# Altium schematic sheet [06] - AUDIO.SchDoc: DOCUMENT TITLE
size A3; Organization: Tor Brodtkorb; Address1: Frode Rinnans veg 193; Address2: 7050 Trondheim; DocumentNumber: 6598; Revision: 1.0; SheetNumber: 1; SheetTotal: 1
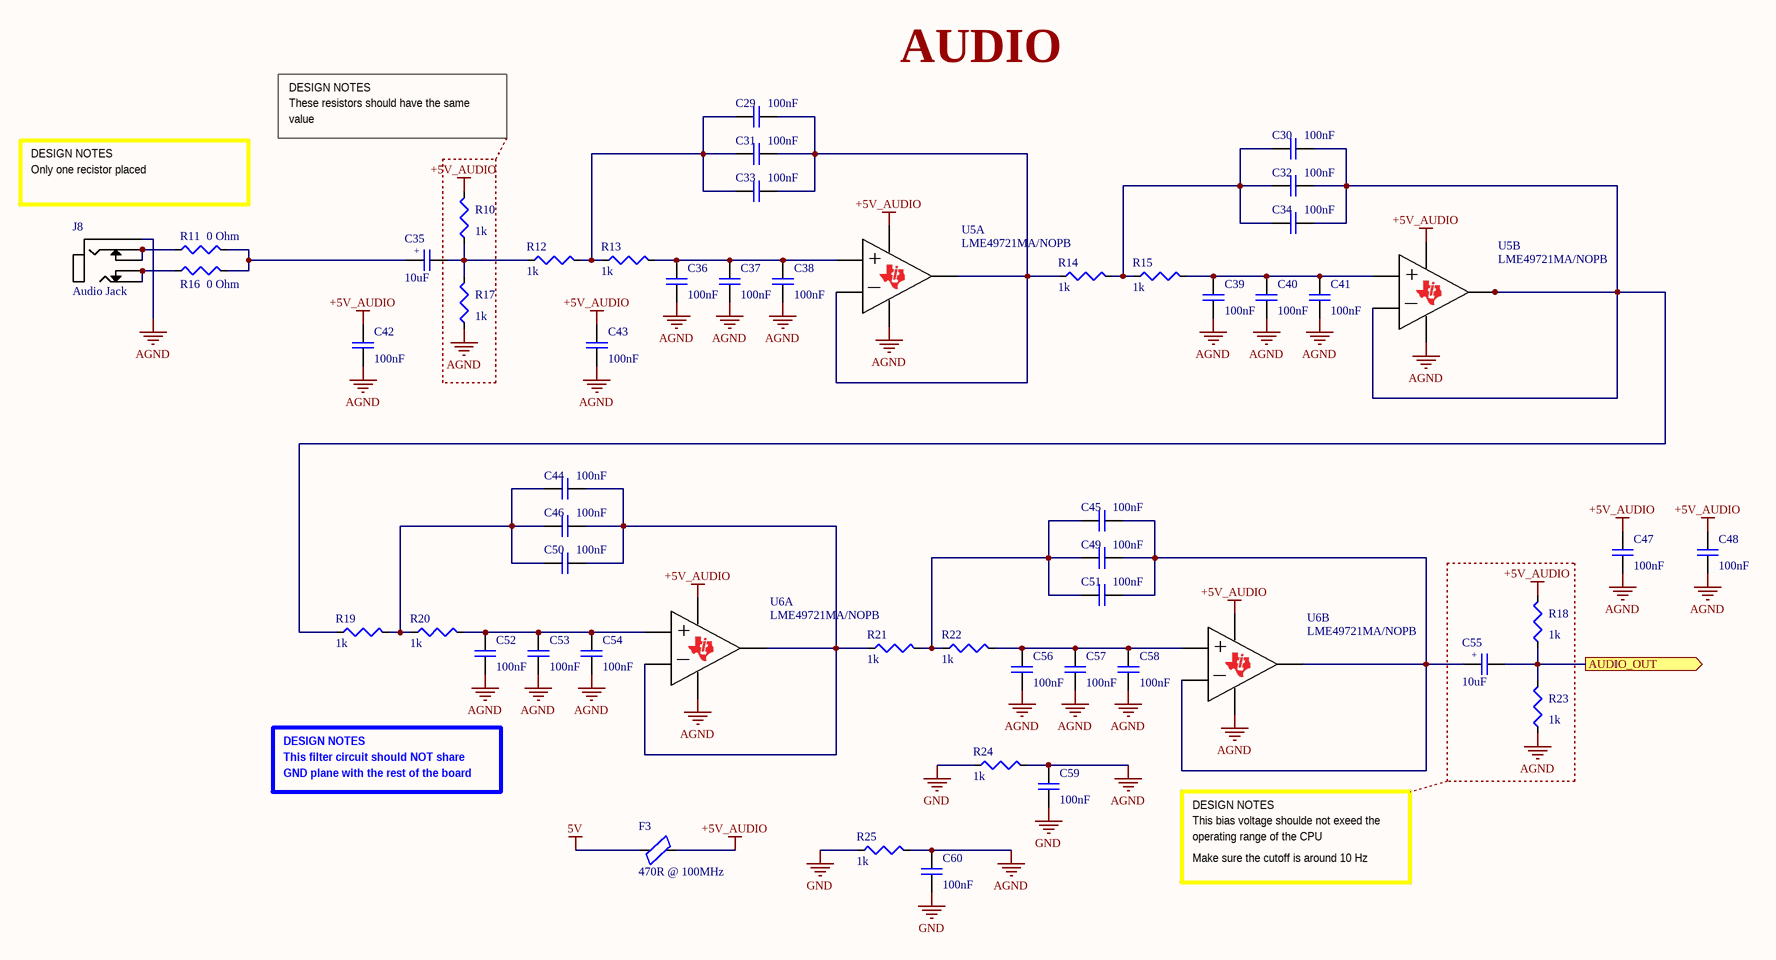
[diagram p0: [06] - AUDIO.SchDoc]

## Parts
C29  value 100nF  [C0603]  (hidden comment: 02016D104KAT2A)
C30  value 100nF  [C0603]  (hidden comment: 02016D104KAT2A)
C31  value 100nF  [C0603]  (hidden comment: 02016D104KAT2A)
C32  value 100nF  [C0603]  (hidden comment: 02016D104KAT2A)
C33  value 100nF  [C0603]  (hidden comment: 02016D104KAT2A)
C34  value 100nF  [C0603]  (hidden comment: 02016D104KAT2A)
C35  value 10uF  [Capacitor electrolytic SMD 4x5.4]  (hidden comment: EEE1HA2R2SR)
C36  value 100nF  [C0603]  (hidden comment: 02016D104KAT2A)
C37  value 100nF  [C0603]  (hidden comment: 02016D104KAT2A)
C38  value 100nF  [C0603]  (hidden comment: 02016D104KAT2A)
C39  value 100nF  [C0603]  (hidden comment: 02016D104KAT2A)
C40  value 100nF  [C0603]  (hidden comment: 02016D104KAT2A)
C41  value 100nF  [C0603]  (hidden comment: 02016D104KAT2A)
C42  value 100nF  [C0603]  (hidden comment: 02016D104KAT2A)
C43  value 100nF  [C0603]  (hidden comment: 02016D104KAT2A)
C44  value 100nF  [C0603]  (hidden comment: 02016D104KAT2A)
C45  value 100nF  [C0603]  (hidden comment: 02016D104KAT2A)
C46  value 100nF  [C0603]  (hidden comment: 02016D104KAT2A)
C47  value 100nF  [C0603]  (hidden comment: 02016D104KAT2A)
C48  value 100nF  [C0603]  (hidden comment: 02016D104KAT2A)
C49  value 100nF  [C0603]  (hidden comment: 02016D104KAT2A)
C50  value 100nF  [C0603]  (hidden comment: 02016D104KAT2A)
C51  value 100nF  [C0603]  (hidden comment: 02016D104KAT2A)
C52  value 100nF  [C0603]  (hidden comment: 02016D104KAT2A)
C53  value 100nF  [C0603]  (hidden comment: 02016D104KAT2A)
C54  value 100nF  [C0603]  (hidden comment: 02016D104KAT2A)
C55  value 10uF  [Capacitor electrolytic SMD 4x5.4]  (hidden comment: EEE1HA2R2SR)
C56  value 100nF  [C0603]  (hidden comment: 02016D104KAT2A)
C57  value 100nF  [C0603]  (hidden comment: 02016D104KAT2A)
C58  value 100nF  [C0603]  (hidden comment: 02016D104KAT2A)
C59  value 100nF  [C0603]  (hidden comment: 02016D104KAT2A)
C60  value 100nF  [C0603]  (hidden comment: 02016D104KAT2A)
F3  value 470R @ 100MHz  [Ferrite bead 0603]  (hidden comment: BLM18AG121SN1D)
J8  Audio Jack  [Audio jack flat]
R10  value 1k  [R0603]  (hidden comment: CPF-A-0603B100KE1)
R11  value 0 Ohm  [R0603]  (hidden comment: CPF-A-0603B100KE1)
R12  value 1k  [R0603]  (hidden comment: CPF-A-0603B100KE1)
R13  value 1k  [R0603]  (hidden comment: CPF-A-0603B100KE1)
R14  value 1k  [R0603]  (hidden comment: CPF-A-0603B100KE1)
R15  value 1k  [R0603]  (hidden comment: CPF-A-0603B100KE1)
R16  value 0 Ohm  [R0603]  (hidden comment: CPF-A-0603B100KE1)
R17  value 1k  [R0603]  (hidden comment: CPF-A-0603B100KE1)
R18  value 1k  [R0603]  (hidden comment: CPF-A-0603B100KE1)
R19  value 1k  [R0603]  (hidden comment: CPF-A-0603B100KE1)
R20  value 1k  [R0603]  (hidden comment: CPF-A-0603B100KE1)
R21  value 1k  [R0603]  (hidden comment: CPF-A-0603B100KE1)
R22  value 1k  [R0603]  (hidden comment: CPF-A-0603B100KE1)
R23  value 1k  [R0603]  (hidden comment: CPF-A-0603B100KE1)
R24  value 1k  [R0603]  (hidden comment: CPF-A-0603B100KE1)
R25  value 1k  [R0603]  (hidden comment: CPF-A-0603B100KE1)
U5  LME49721MA/NOPB  [LME49721MA/NOPB]  (parts A,B of 2)
U6  LME49721MA/NOPB  [LME49721MA/NOPB]  (parts A,B of 2)

## Ports
AUDIO_OUT (out)

## Nets
5V: F3.1
+5V_AUDIO: C42.2 C43.2 C47.2 C48.2 F3.2 R10.2 R18.2 U5.8(VDD) U6.8(VDD)
AGND: C36.1 C37.1 C38.1 C39.1 C40.1 C41.1 C42.1 C43.1 C47.1 C48.1 C52.1 C53.1 C54.1 C56.1 C57.1 C58.1 C59.2 C60.2 J8.1 R17.1 R23.1 R24.2 R25.2 U5.4(VDD) U6.4(VDD)
GND: C59.1 C60.1 R24.1 R25.1
AUDIO_OUT: C55.2 R18.1 R23.2 ; port AUDIO_OUT
NetC29_1: C29.1 C31.1 C33.1 R12.2 R13.1
NetC29_2: C29.2 C31.2 C33.2 R14.1 U5.1(VDD) U5.2(VDD)
NetC30_1: C30.1 C32.1 C34.1 R14.2 R15.1
NetC30_2: C30.2 C32.2 C34.2 R19.1 U5.6(VDD) U5.7(VDD)
NetC35_1: C35.1 R11.2 R16.2
NetC35_2: C35.2 R10.1 R12.1 R17.2
NetC36_2: C36.2 C37.2 C38.2 R13.2 U5.3(VDD)
NetC39_2: C39.2 C40.2 C41.2 R15.2 U5.5(VDD)
NetC44_1: C44.1 C46.1 C50.1 R19.2 R20.1
NetC44_2: C44.2 C46.2 C50.2 R21.1 U6.1(VDD) U6.2(VDD)
NetC45_1: C45.1 C49.1 C51.1 R21.2 R22.1
NetC45_2: C45.2 C49.2 C51.2 C55.1 U6.6(VDD) U6.7(VDD)
NetC52_2: C52.2 C53.2 C54.2 R20.2 U6.3(VDD)
NetC56_2: C56.2 C57.2 C58.2 R22.2 U6.5(VDD)
NetJ8_2: J8.2 J8.3 R11.1
NetJ8_4: J8.4 J8.5 R16.1

## Notes on the sheet
- DESIGN NOTES
- These resistors should have the same
- value
- AUDIO
- Only one recistor placed
- This filter circuit should NOT share
- GND plane with the rest of the board
- This bias voltage shoulde not exeed the
- operating range of the CPU
- Make sure the cutoff is around 10 Hz
- Title
- Size:
- Date:
- A3
- Number:
- Time:
- Revision:
- Sheet
- of
- File:
- (in symbol EEE1HA2R2SR) +
- (in symbol LME49721MA/NOPB, part A) +; _
- (in symbol LME49721MA/NOPB, part B) +; _

## Library data of the parts
C29-C34 C36-C54 C56-C60 = 02016D104KAT2A: C0603
C35 C55 = EEE1HA2R2SR: El. Capacitor SMD 4x5.4
F3 = BLM18AG121SN1D: Ferrite bead 0603
J8 = FC68133: Audio jack flat 5 contacts; Supplier Part Number 1: 2518190; Supplier 1: Farnell
R10-R25 = CPF-A-0603B100KE1: R0603
U5 U6 = LME49721MA/NOPB: Audio OP amp, single supply, low voltage